# Altium schematic sheet Safety Loops.SchDoc
size A4
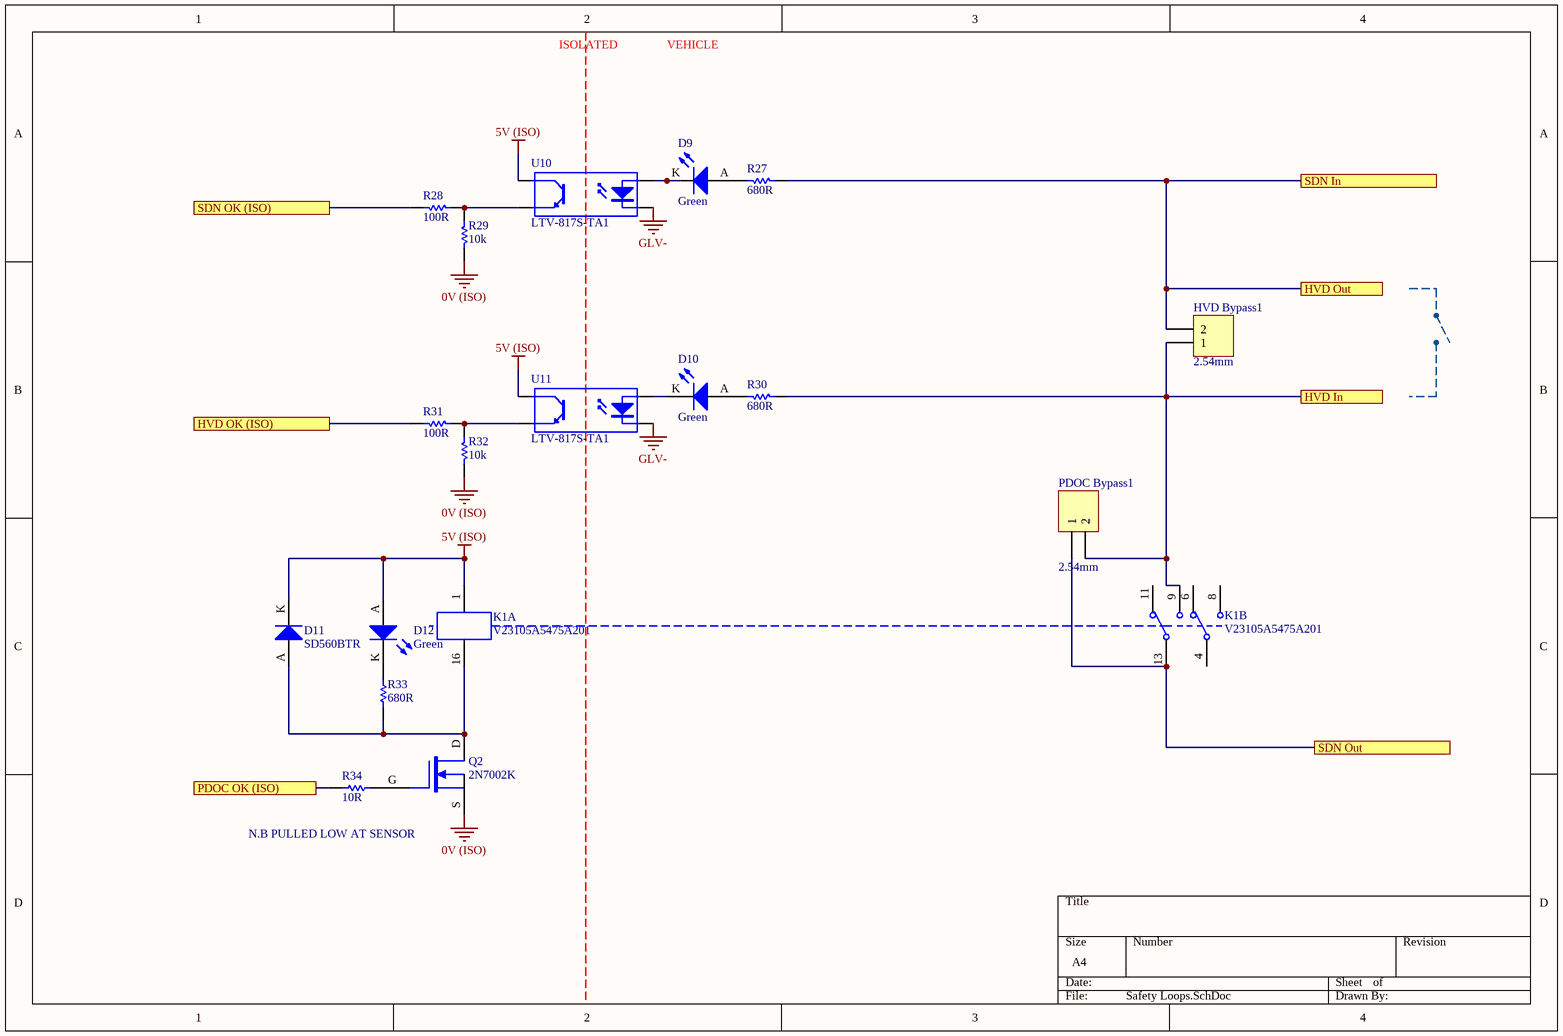
[diagram p0: Safety Loops.SchDoc]

## Parts
D9  Green  [0805 LED]
D10  Green  [0805 LED]
D11  SD560BTR  [SMB Diode]
D12  Green  [0805 LED]
HVD_Bypass1  2.54mm  [TH 2.54mm Header 1x2]
K1  V23105A5475A201  [TI 2-DIL]  (parts A,B of 2)
PDOC_Bypass1  2.54mm  [TH 2.54mm Header 1x2]
Q2  2N7002K  [ON SOT-23 MOSFET]
R27  680R  [0805]
R28  100R  [0805]
R29  10k  [0805]
R30  680R  [0805]
R31  100R  [0805]
R32  10k  [0805]
R33  680R  [0805]
R34  10R  [0805]
U10  LTV-817S-TA1  [ON 4-SMD]
U11  LTV-817S-TA1  [ON 4-SMD]

## Ports
HVD In, HVD OK (ISO), HVD Out, PDOC OK (ISO), SDN In, SDN OK (ISO), SDN Out

## Nets
0V (ISO): Q2.S R29.1 R32.1
5V (ISO): D11.K D12.A K1.1 U10.4(C) U11.4(C)
GLV-: U10.2(K) U11.2(K)
HVD In: HVD_Bypass1.1 K1.9 PDOC_Bypass1.2 R30.2 ; port HVD In
HVD OK (ISO): R31.2 ; port HVD OK (ISO)
HVD Out: HVD_Bypass1.2 R27.2 ; port HVD Out, port SDN In
PDOC OK (ISO): R34.1 ; port PDOC OK (ISO)
SDN OK (ISO): R28.2 ; port SDN OK (ISO)
SDN Out: K1.13 PDOC_Bypass1.1 ; port SDN Out
NetD9_A: D9.A R27.1
NetD9_K: D9.K U10.1(A)
NetD10_A: D10.A R30.1
NetD10_K: D10.K U11.1(A)
NetD11_A: D11.A K1.16 Q2.D R33.1
NetD12_K: D12.K R33.2
NetQ2_G: Q2.G R34.2
NetR28_1: R28.1 R29.2 U10.3(E)
NetR31_1: R31.1 R32.2 U11.3(E)

Not connected (* = marked no-connect by the designer): K1 4 6 8 11

## Notes on the sheet
- ISOLATED
- VEHICLE
- N.B PULLED LOW AT SENSOR

## Library data of the parts
D9 D10 D12 = SML-210FTT86: Green LED Indication - Discrete 1.75V 0805 (2012 Metric); Manufacturer: ROHM Semiconductor; Part Number: SML-210FTT86; Colour: Green; Digikey Part Number: 511-1285-1-ND; Digikey Link: https://www.digikey.com/product-detail/en/rohm-semiconductor/SML-210FTT86/511-1285-1-ND/637098
D11 = SD560BTR: 1.2V_F 600V 5A SMB; Manufacturer: SMC Diode Solutions; Part Number: SD560BTR; Digikey Part Number: 1655-1530-2-ND; Digikey Link: https://www.digikey.com/product-detail/en/smc-diode-solutions/SD560BTR/1655-1530-2-ND/6022620
HVD_Bypass1 PDOC_Bypass1 = TH 2.54mm Header 1x2: Positions: 2; Angle: 0; Flange: No; Contact: NA; Part Number: TH 2.54mm Header 1x2; Pitch: 2.54mm; Row Spacing: 2.54mm
K1 = V23105A5475A201: 5V DPDT Relay 3A 220VDC; Manufacturer: Axicom; Part Number: V23105A5475A201; Digikey Part Number: PB383-ND; Digikey Link: https://www.digikey.com/products/en?mpart=V23105A5001A201&v=41
Q2 = 2N7002K: 60V 380mA, NFET MOSTFET (Small Signal); Manufacturer: ON Semiconductor; Published: 24-Mar-1999; LatestRevisionDate: 29-May-2009; LatestRevisionNote: IPC-7351 Footprint Added.; PackageVersion: Sep-2000; PackageReference: SOT-343; Publisher: Altium Limited; PackageDescription: 4-Pin SOT-343 Package 1.3 mm Pitch, 2.1 mm Lead Span; Part Number: 2N7002K; Digikey Part Number: 2N7002KCT-ND; Digikey Link: https://www.digikey.com/product-detail/en/on-semiconductor/2N7002K/2N7002KCT-ND/2060375; Qty: 30
R27 R30 R33 = RC0805FR07680RL: Manufacturer: YAGEO; Tolerance: 0.01; Rated Voltage: 0.125W; Part Number: RC0805FR07680RL; Value: 680R; Material: FR-07
R28 R31 = RC0805FR07100RL: Manufacturer: YAGEO; Tolerance: 0.01; Rated Voltage: 0.125W; Part Number: RC0805FR07100RL; Value: 100R; Material: FR-07
R29 R32 = RC0805FR0710KL: Manufacturer: YAGEO; Tolerance: 0.01; Rated Voltage: 0.125W; Part Number: RC0805FR0710KL; Value: 10k; Material: FR-07
R34 = RC0805FR0710RL: Manufacturer: YAGEO; Tolerance: 0.01; Rated Voltage: 0.125W; Part Number: RC0805FR0710RL; Value: 10R; Material: FR-07
U10 U11 = LTV-817S-TA1: 35V 50ma Optocoupler (VF=1.2V); Manufacturer: Lite-On Inc; Part Number: LTV-817S-TA1; Digikey Part Number: 160-1893-2-ND; Digikey Link: https://www.digikey.com/product-detail/en/lite-on-inc/LTV-817S-TA1/160-1893-2-ND/388451